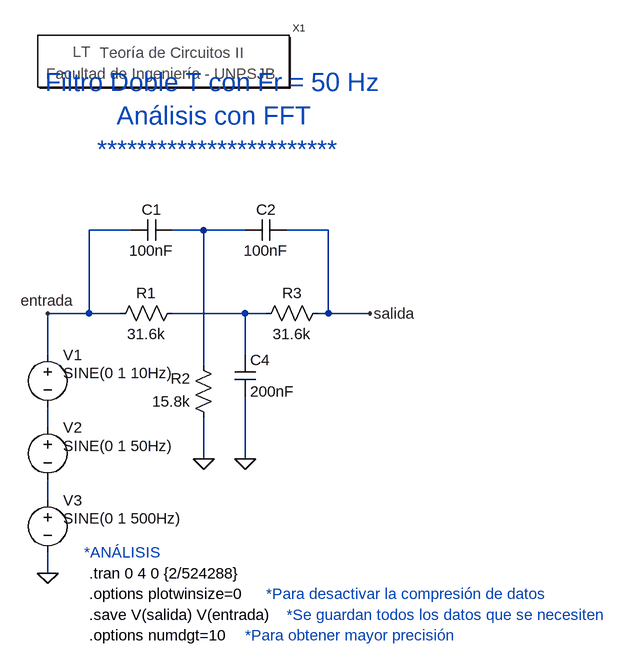
[diagram p0: schematic Filtro suprimebanda doble t para visualizar st.asc]
Filtro suprimebanda doble t para visualizar st.asc, the LTspice schematic file:
Version 4
SHEET 1 880 724
WIRE 96 80 32 80
WIRE 208 80 160 80
WIRE 272 80 208 80
WIRE 400 80 336 80
WIRE 32 208 32 80
WIRE 32 208 -32 208
WIRE 80 208 32 208
WIRE 272 208 160 208
WIRE 304 208 272 208
WIRE 400 208 400 80
WIRE 400 208 384 208
WIRE 464 208 400 208
WIRE -32 272 -32 208
WIRE 272 272 272 208
WIRE 208 288 208 80
WIRE -32 384 -32 352
WIRE 208 432 208 368
WIRE 272 432 272 336
WIRE -32 496 -32 464
WIRE -32 608 -32 576
FLAG 208 432 0
FLAG 272 432 0
FLAG 464 208 salida
FLAG -32 608 0
FLAG -32 208 entrada
SYMBOL cap 160 64 R90
WINDOW 0 0 32 VBottom 2
WINDOW 3 32 32 VTop 2
SYMATTR InstName C1
SYMATTR Value 100nF
SYMBOL cap 336 64 R90
WINDOW 0 0 32 VBottom 2
WINDOW 3 32 32 VTop 2
SYMATTR InstName C2
SYMATTR Value 100nF
SYMBOL res 176 192 R90
WINDOW 0 0 56 VBottom 2
WINDOW 3 32 56 VTop 2
SYMATTR InstName R1
SYMATTR Value 31.6k
SYMBOL res 224 384 R180
WINDOW 0 36 76 Left 2
WINDOW 3 36 40 Left 2
SYMATTR InstName R2
SYMATTR Value 15.8k
SYMBOL cap 256 272 R0
SYMATTR InstName C4
SYMATTR Value 200nF
SYMBOL res 400 192 R90
WINDOW 0 0 56 VBottom 2
WINDOW 3 32 56 VTop 2
SYMATTR InstName R3
SYMATTR Value 31.6k
SYMBOL voltage -32 256 R0
WINDOW 123 24 124 Left 2
WINDOW 39 0 0 Left 2
WINDOW 3 24 44 Left 2
SYMATTR InstName V1
SYMATTR Value SINE(0 1 10Hz)
SYMBOL Circuitos2\\Letreros\\Teoría\ de\ Circuitos\ II 144 -176 R0
SYMATTR InstName X1
SYMBOL voltage -32 368 R0
WINDOW 123 24 124 Left 2
WINDOW 39 0 0 Left 2
WINDOW 3 24 44 Left 2
SYMATTR InstName V2
SYMATTR Value SINE(0 1 50Hz)
SYMBOL voltage -32 480 R0
WINDOW 123 24 124 Left 2
WINDOW 39 0 0 Left 2
WINDOW 3 24 44 Left 2
SYMATTR InstName V3
SYMATTR Value SINE(0 1 500Hz)
TEXT 24 576 Left 2 ;*ANÁLISIS
TEXT 224 -96 Center 4 ;Filtro Doble T con Fr = 50 Hz\nAnálisis con FFT\n************************
TEXT 32 608 Left 2 !.tran 0 4 0 {2/524288}
TEXT 32 640 Left 2 !.options plotwinsize=0
TEXT 304 640 Left 2 ;*Para desactivar la compresión de datos
TEXT 32 672 Left 2 !.save V(salida) V(entrada)
TEXT 336 672 Left 2 ;*Se guardan todos los datos que se necesiten
TEXT 32 704 Left 2 !.options numdgt=10
TEXT 272 704 Left 2 ;*Para obtener mayor precisión

The netlist it stands for:
* Filtro suprimebanda doble t para visualizar st.asc
C1 N001 entrada 100nF
C2 salida N001 100nF
R1 N002 entrada 31.6k
R2 0 N001 15.8k
C4 N002 0 200nF
R3 salida N002 31.6k
V1 entrada N003 SINE(0 1 10Hz)
XX1 Teoría de Circuitos II
V2 N003 N004 SINE(0 1 50Hz)
V3 N004 0 SINE(0 1 500Hz)
* *ANÁLISIS
* Filtro Doble T con Fr = 50 Hz
* Análisis con FFT
* ************************
.tran 0 4 0 {2/524288}
.options plotwinsize=0
* *Para desactivar la compresión de datos
.save V(salida) V(entrada)
* *Se guardan todos los datos que se necesiten
.options numdgt=10
* *Para obtener mayor precisión
.backanno
.end